# Altium project WR_NIC.PrjPcb (part 2 of 3)

## Sheet 11-DisplayPort.SchDoc
size B; SheetNumber: 10; SheetTotal: 19
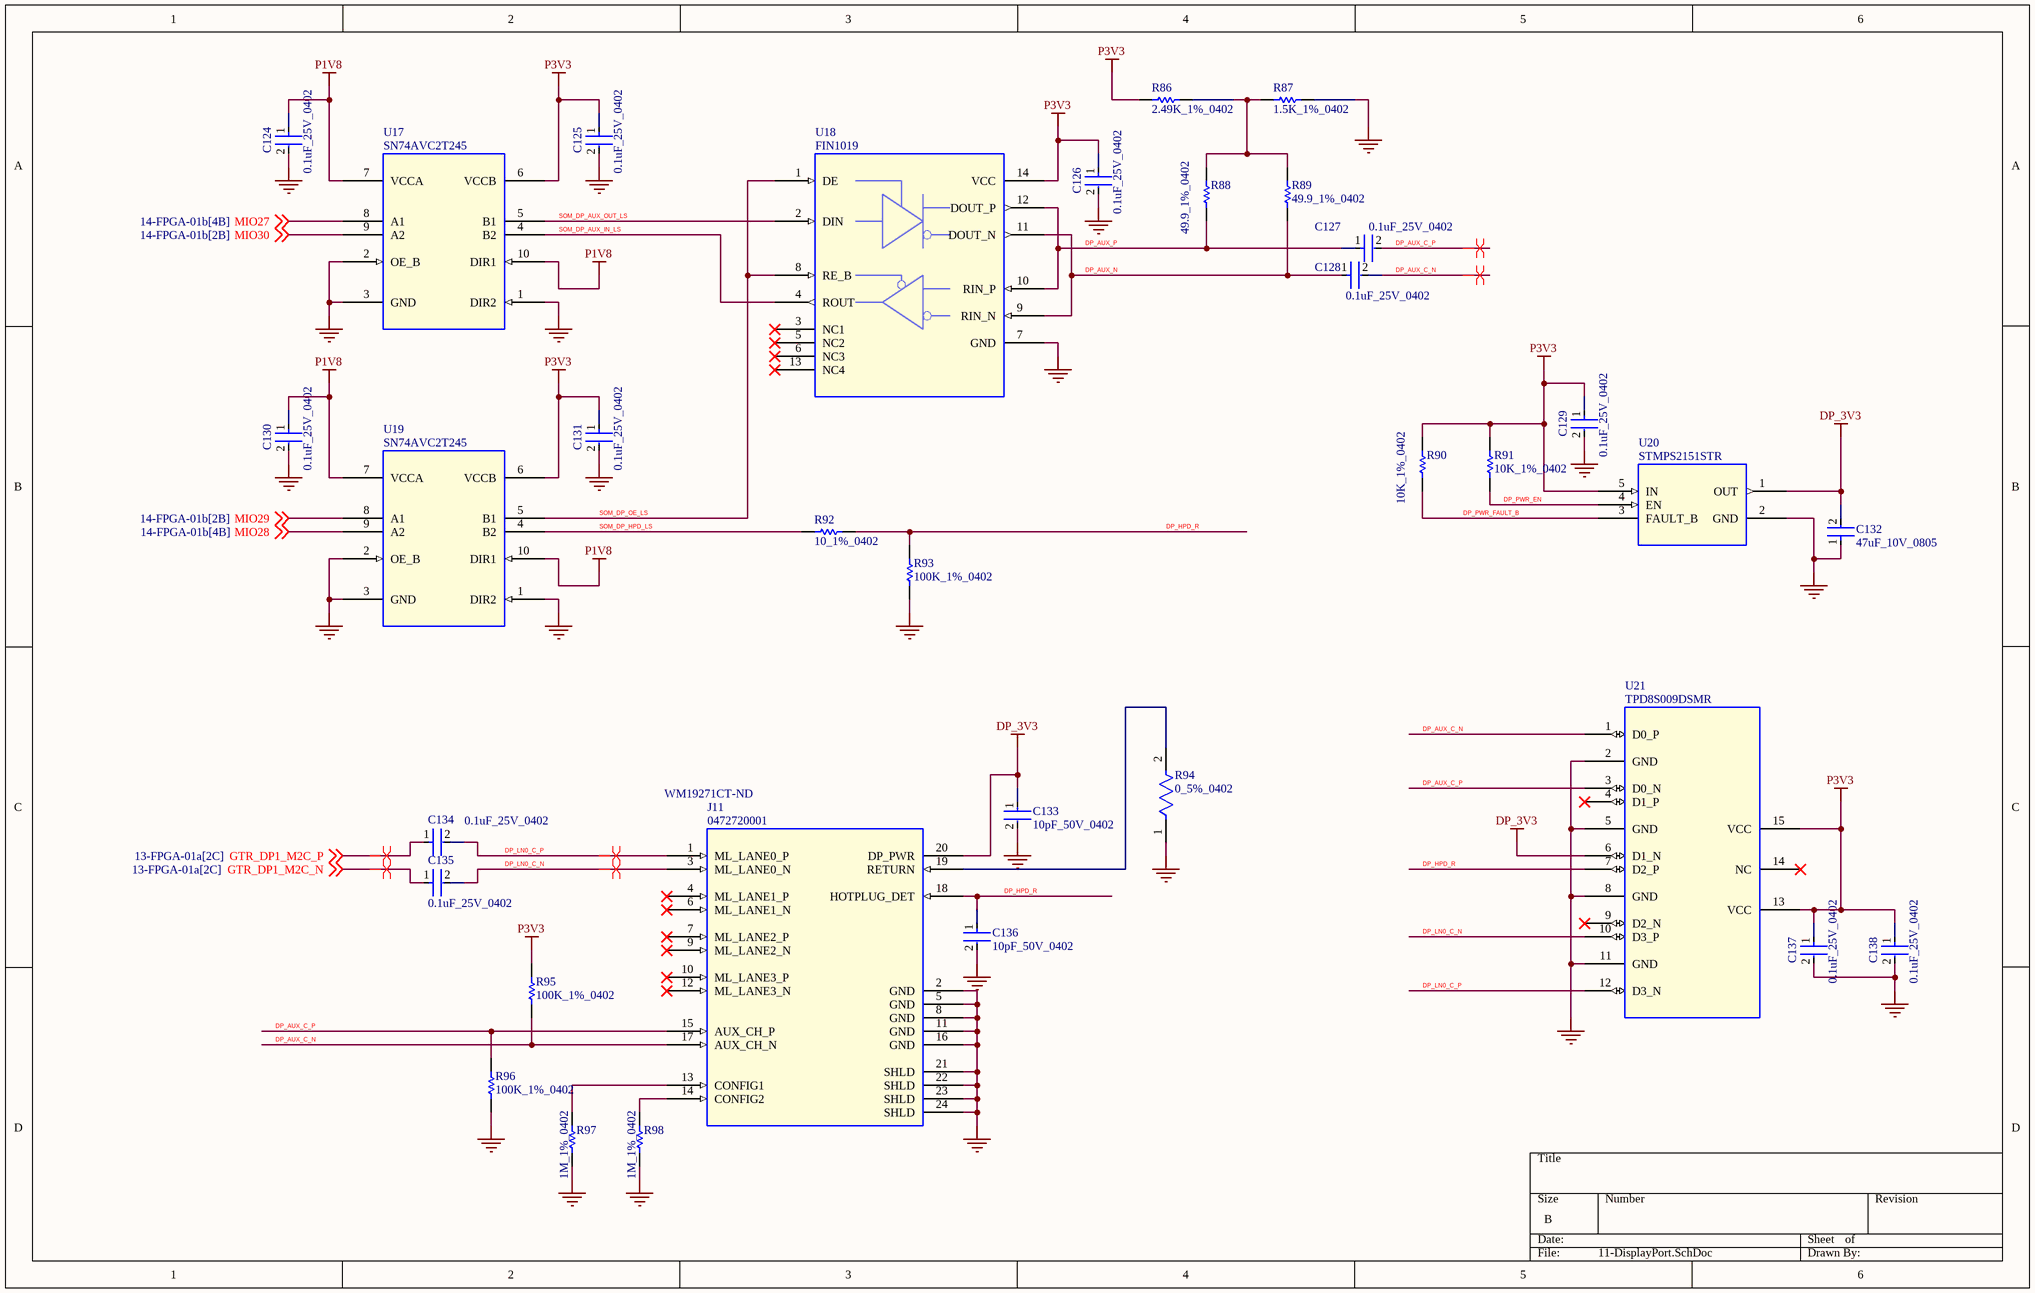
[diagram p5: 11-DisplayPort.SchDoc]

### Parts
C124  0.1uF_25V_0402  [FP-0402-L_1_0_1-W_0_5_0_1-IPC_C]
C125  0.1uF_25V_0402  [FP-0402-L_1_0_1-W_0_5_0_1-IPC_C]
C126  0.1uF_25V_0402  [FP-0402-L_1_0_1-W_0_5_0_1-IPC_C]
C127  0.1uF_25V_0402  [FP-0402-L_1_0_1-W_0_5_0_1-IPC_C]
C128  0.1uF_25V_0402  [FP-0402-L_1_0_1-W_0_5_0_1-IPC_C]
C129  0.1uF_25V_0402  [FP-0402-L_1_0_1-W_0_5_0_1-IPC_C]
C130  0.1uF_25V_0402  [FP-0402-L_1_0_1-W_0_5_0_1-IPC_C]
C131  0.1uF_25V_0402  [FP-0402-L_1_0_1-W_0_5_0_1-IPC_C]
C132  47uF_10V_0805  [FP-GRM21B-0_2-e0_2_0_7-IPC_A]
C133  10pF_50V_0402  [FP-C1005-050-0_05-IPC_C]
C134  0.1uF_25V_0402  [FP-0402-L_1_0_1-W_0_5_0_1-IPC_C]
C135  0.1uF_25V_0402  [FP-0402-L_1_0_1-W_0_5_0_1-IPC_C]
C136  10pF_50V_0402  [FP-C1005-050-0_05-IPC_C]
C137  0.1uF_25V_0402  [FP-0402-L_1_0_1-W_0_5_0_1-IPC_C]
C138  0.1uF_25V_0402  [FP-0402-L_1_0_1-W_0_5_0_1-IPC_C]
J11  0472720001  Supplier Part Number 1: WM19271CT-ND  [CON_MOLEX_47272]
R86  2.49K_1%_0402  [RESC1005X40X25ML05T05]
R87  1.5K_1%_0402  [RESC1005X40X25NL05T05]
R88  49.9_1%_0402  [RESC1005X40X25NL10T10]
R89  49.9_1%_0402  [RESC1005X40X25NL10T10]
R90  10K_1%_0402  [RESC1005X40X25ML05T05]
R91  10K_1%_0402  [RESC1005X40X25ML05T05]
R92  10_1%_0402  [RESC1005X40X25LL10T10]
R93  100K_1%_0402  [RESC1005X40X25ML05T05]
R94  0_5%_0402  [FP-AC0402-0_37-IPC_B]
R95  100K_1%_0402  [RESC1005X40X25ML05T05]
R96  100K_1%_0402  [RESC1005X40X25ML05T05]
R97  1M_1%_0402  [RESC1005X40X25NL10T10]
R98  1M_1%_0402  [RESC1005X40X25NL10T10]
U17  SN74AVC2T245  [QFN40P140X180X55-10]
U18  FIN1019  [TSSOP_14]
U19  SN74AVC2T245  [QFN40P140X180X55-10]
U20  STMPS2151STR  [SOT95P280X145_5]
U21  TPD8S009DSMR  [SON_15P]

### Nets
DP_3V3: C132.2 C133.1 J11.20(DP_PWR) U20.1(OUT) U21.6(D1_N)
GND: C124.2 C125.2 C126.2 C129.2 C130.2 C131.2 C132.1 C133.2 C136.2 C137.2 C138.2 J11.2(GND) J11.5(GND) J11.8(GND) J11.11(GND) J11.16(GND) J11.21(SHLD) J11.22(SHLD) J11.23(SHLD) J11.24(SHLD) R87.2 R93.2 R94.1 R96.1 R97.1 R98.1 U17.1(DIR2) U17.2(OE_B) U17.3(GND) U18.7(GND) U19.1(DIR2) U19.2(OE_B) U19.3(GND) U20.2(GND) U21.2(GND) U21.5(GND) U21.8(GND) U21.11(GND)
P1V8: C124.1 C130.1 U17.7(VCCA) U17.10(DIR1) U19.7(VCCA) U19.10(DIR1)
P3V3: C125.1 C126.1 C129.1 C131.1 C137.1 C138.1 R86.1 R90.2 R91.1 R95.2 U17.6(VCCB) U18.14(VCC) U19.6(VCCB) U20.5(IN) U21.13(VCC) U21.15(VCC)
DP_AUX_C_N: C128.2 J11.17(AUX_CH_N) R95.1 U21.1(D0_P)
DP_AUX_C_P: C127.2 J11.15(AUX_CH_P) R96.2 U21.3(D0_N)
DP_AUX_N: C128.1 R89.1 U18.9(RIN_N) U18.11(DOUT_N)
DP_AUX_P: C127.1 R88.1 U18.10(RIN_P) U18.12(DOUT_P)
DP_HPD_R: C136.1 J11.18(HOTPLUG_DET) R92.2 R93.1 U21.7(D2_P)
DP_LN0_C_N: C135.2 J11.3(ML_LANE0_N) U21.10(D3_P)
DP_LN0_C_P: C134.2 J11.1(ML_LANE0_P) U21.12(D3_N)
DP_PWR_EN: R91.2 U20.4(EN)
DP_PWR_FAULT_B: R90.1 U20.3(FAULT_B)
GTR_DP1_M2C_N: C135.1 ; off-sheet GTR_DP1_M2C_N
GTR_DP1_M2C_P: C134.1 ; off-sheet GTR_DP1_M2C_P
MIO27: U17.8(A1) ; off-sheet MIO27
MIO28: U19.9(A2) ; off-sheet MIO28
MIO29: U19.8(A1) ; off-sheet MIO29
MIO30: U17.9(A2) ; off-sheet MIO30
SOM_DP_AUX_IN_LS: U17.4(B2) U18.4(ROUT)
SOM_DP_AUX_OUT_LS: U17.5(B1) U18.2(DIN)
SOM_DP_HPD_LS: R92.1 U19.4(B2)
SOM_DP_OE_LS: U18.1(DE) U18.8(RE_B) U19.5(B1)
NetJ11_13: J11.13(CONFIG1) R97.2
NetJ11_14: J11.14(CONFIG2) R98.2
NetJ11_19: J11.19(RETURN) R94.2
NetR86_2: R86.2 R87.1 R88.2 R89.2

Not connected (* = marked no-connect by the designer): J11 4(ML_LANE1_P)* 6(ML_LANE1_N)* 7(ML_LANE2_P)* 9(ML_LANE2_N)* 10(ML_LANE3_P)* 12(ML_LANE3_N)*; U18 3(NC1)* 5(NC2)* 6(NC3)* 13(NC4)*; U21 4(D1_P)* 9(D2_N)* 14(NC)*

### Layout directives
differential pair: DP_AUX_C_N, DP_AUX_C_P, DP_LN0_C_N, DP_LN0_C_P, GTR_DP1_M2C_N, GTR_DP1_M2C_P

### Library data of the parts
C124-C131 C134 C135 C137 C138 = CMP-2008-02519-2: General Purpose Ceramic Capacitor, 0402, 100nF, 10%, X7R, 15%, 25V; Package Quantity: 1; Capacitance: 100nF; Min Operating Temperature: -55°C; Voltage: 25V; Voltage Rating: 25V; Construction: Flat; Max Operating Temperature: 125°C; Radiation Hardening: No; Depth: 0.5mm; Thickness: 0.022inch; Voltage Rating (DC): 25V; Number of Pins: 2; Lead Free: Lead Free; Series: -; REACH SVHC: No SVHC; Length: 1mm; Dielectric: X7R; RoHS Compliant: Yes; Mount: Surface Mount; Packaging: Tape and Reel; Case/Package: 0402; Case Code (Imperial): 0402; Termination: SMD/SMT; Width: 0.02inch; Case Code (Metric): 1005; Tolerance: 10%
C132 = CMP-2000-06341-2: Chip Multilayer Ceramic Capacitors for General Purpose, 0805, 47uF, X5R, 15%, 20%, 10V; Dissipation Factor: 0.035%; Length: 2mm; Voltage Rating: 10V; Mount: Surface Mount; Width: 0.049inch; Voltage Rating (DC): 10V; Lead Free: Lead Free; REACH SVHC: No SVHC; Termination: SMD/SMT; Case/Package: 0805; Dielectric: X5R; Capacitance: 47uF; Packaging: Tape and Reel; Max Operating Temperature: 85°C; Tolerance: 20%; Thickness: 0.057inch; Dielectric Material: Ceramic; Min Operating Temperature: -55°C; Height: 1.25mm; Case Code (Imperial): 0805; Case Code (Metric): 2012; Depth: 1.25mm; Voltage: 10V
C133 C136 = CMP-08246-002674-1: CAP CER 10PF 50V C0G 0402; Temperature Coefficient: 30ppm/°C; Dielectric Material: Ceramic; Termination: SMD/SMT; Width: 0.02inch; Case Code (Metric): 1005; Thickness: 0.022inch; Height: 0.5mm; REACH SVHC: No SVHC; Case Code (Imperial): 0402; Voltage: 50V; Capacitance: 10pF; Max Operating Temperature: 125°C; Length: 1mm; Construction: Flat; Packaging: Tape and Reel; Lead Free: Lead Free; Series: C; Depth: 0.5mm; Dielectric: C0G; Package Quantity: 1; Mount: Surface Mount; Voltage Rating (DC): 50V; Voltage Rating: 50V; Case/Package: 0402; RoHS Compliant: Yes; Min Operating Temperature: -55°C; Number of Pins: 2; Radiation Hardening: No; Weight: 2.3E-05oz
J11 = 0472720001: Conn Rcpt DisplayPort Female RA 20 Pos 0.5mm P Black SMT; Agile Part Number: CON-00139-01; Manufacturer: MOLEX; EDMVersionID: 488745758; Barcode: 400070; Part Type: RECEPTACLE; CIP Link: http://xsjbrdwin1/CIP-E/Component/Index/All?pn=400070; Manufacturer PN: 0472720001; PCB Footprint: CON_MOLEX_47272; Supplier 1: Digi-Key
R86 = CMP-2002-00377-1: Manufacturer: Vishay Dale; Part Number: CRCW04022K49FKTD
R87 = CMP-2002-08297-1: Part Number: CRCW04021K50FKED; Manufacturer: Vishay Dale
R88 R89 = CMP-2002-04448-1: Part Number: RK73H1ETTP49R9F; Manufacturer: KOA Speer
R90 R91 = CMP-2002-00433-1: Part Number: ERJ-2GEJ103X; Manufacturer: Panasonic
R92 = CMP-2002-04187-1: Part Number: RK73H1ETTP10R0F; Manufacturer: KOA Speer
R93 R95 R96 = CMP-1011-00736-2: Part Number: CRCW0402100KFKTD; Manufacturer: Vishay Dale
R94 = CMP-2002-01772-2: RESISTOR 0402 JUMPER ZERO OHM; Voltage Rating: 50V; Temperature Coefficient: 200ppm/°C; Tolerance: 1%; Power Rating: 62.5mW; Resistance: 0R; Min Operating Temperature: -55°C; Termination: SMD/SMT; Case/Package: 0402; Case Code (Imperial): 0402; Packaging: Tape and Reel; Case Code (Metric): 1005; Max Operating Temperature: 155°C; Series: AC
R97 R98 = CMP-2002-05706-1: Manufacturer: TE Connectivity / AMP; Part Number: CRG0402F1M0
U17 U19 = SN74AVC2T245: IC Lvl Trans 2-Bit Bidir 500Mbps 1.2-3.6V 50mA UQFN-10; Agile Part Number: ICS-00048-01; Manufacturer: TEXAS INSTRUMENTS; Manufacturer PN: SN74AVC2T245RSWR; EDMVersionID: 493023062; Barcode: 500012; Part Type: BUS TRANSCEIVER; CIP Link: http://xsjbrdwin1/CIP-E/Component/Index/All?pn=500012; PCB Footprint: QFN40P140X180X55-10
U18 = FIN1019: IC Lvl Trans LVTTL-LVDS Diff 400Mbps 3.3V 2.5nSec TSSOP-14; Agile Part Number: ICS-00279-01; Manufacturer: FAIRCHILD; Manufacturer PN: FIN1019MTCX; EDMVersionID: 489931726; Barcode: 500414; Part Type: LVDS DRIVER/RECEIVER; CIP Link: http://xsjbrdwin1/CIP-E/Component/Index/All?pn=500414; PCB Footprint: TSSOP_14
U20 = STMPS2151: IC Switch Power 500mA 2.7-5.5V 110mR SOT23-5; Agile Part Number: ICS-00662-01; Manufacturer: STMicroelectronics; Supply Voltage: Not Required; Barcode: 50000178; CIP Link: http://xsjbrdwin1/CIP-E/Component/Index/All?pn=50000178; Part Type: LOAD SWITCH; Manufacturer PN: STMPS2151STR; Datasheet: http://www.st.com/content/ccc/resource/technical/document/datasheet/e8/d7/48/25/eb/87/45/b3/CD00167470.pdf/files/CD00167470.pdf/jcr:content/translations/en.CD00167470.pdf; PCB Footprint: SOT95P280X145_5
U21 = TPD8S009DSMR: TVSD 8-Ch 5.5V 2.5A 25W 4GHz SON-15 8KV Contact Discharge; Agile Part Number: ICS-00196-01; Manufacturer: TEXAS INSTRUMENTS; EDMVersionID: 493517914; Barcode: 500262; PCB Footprint: SON_15P; CIP Link: http://xsjbrdwin1/CIP-E/Component/Index/All?pn=500262; Part Type: ESD PROTECTOR; Manufacturer PN: TPD8S009DSMR

## Sheet 12-USB Phy and Hub.SchDoc
size C; SheetNumber: 12; SheetTotal: 20
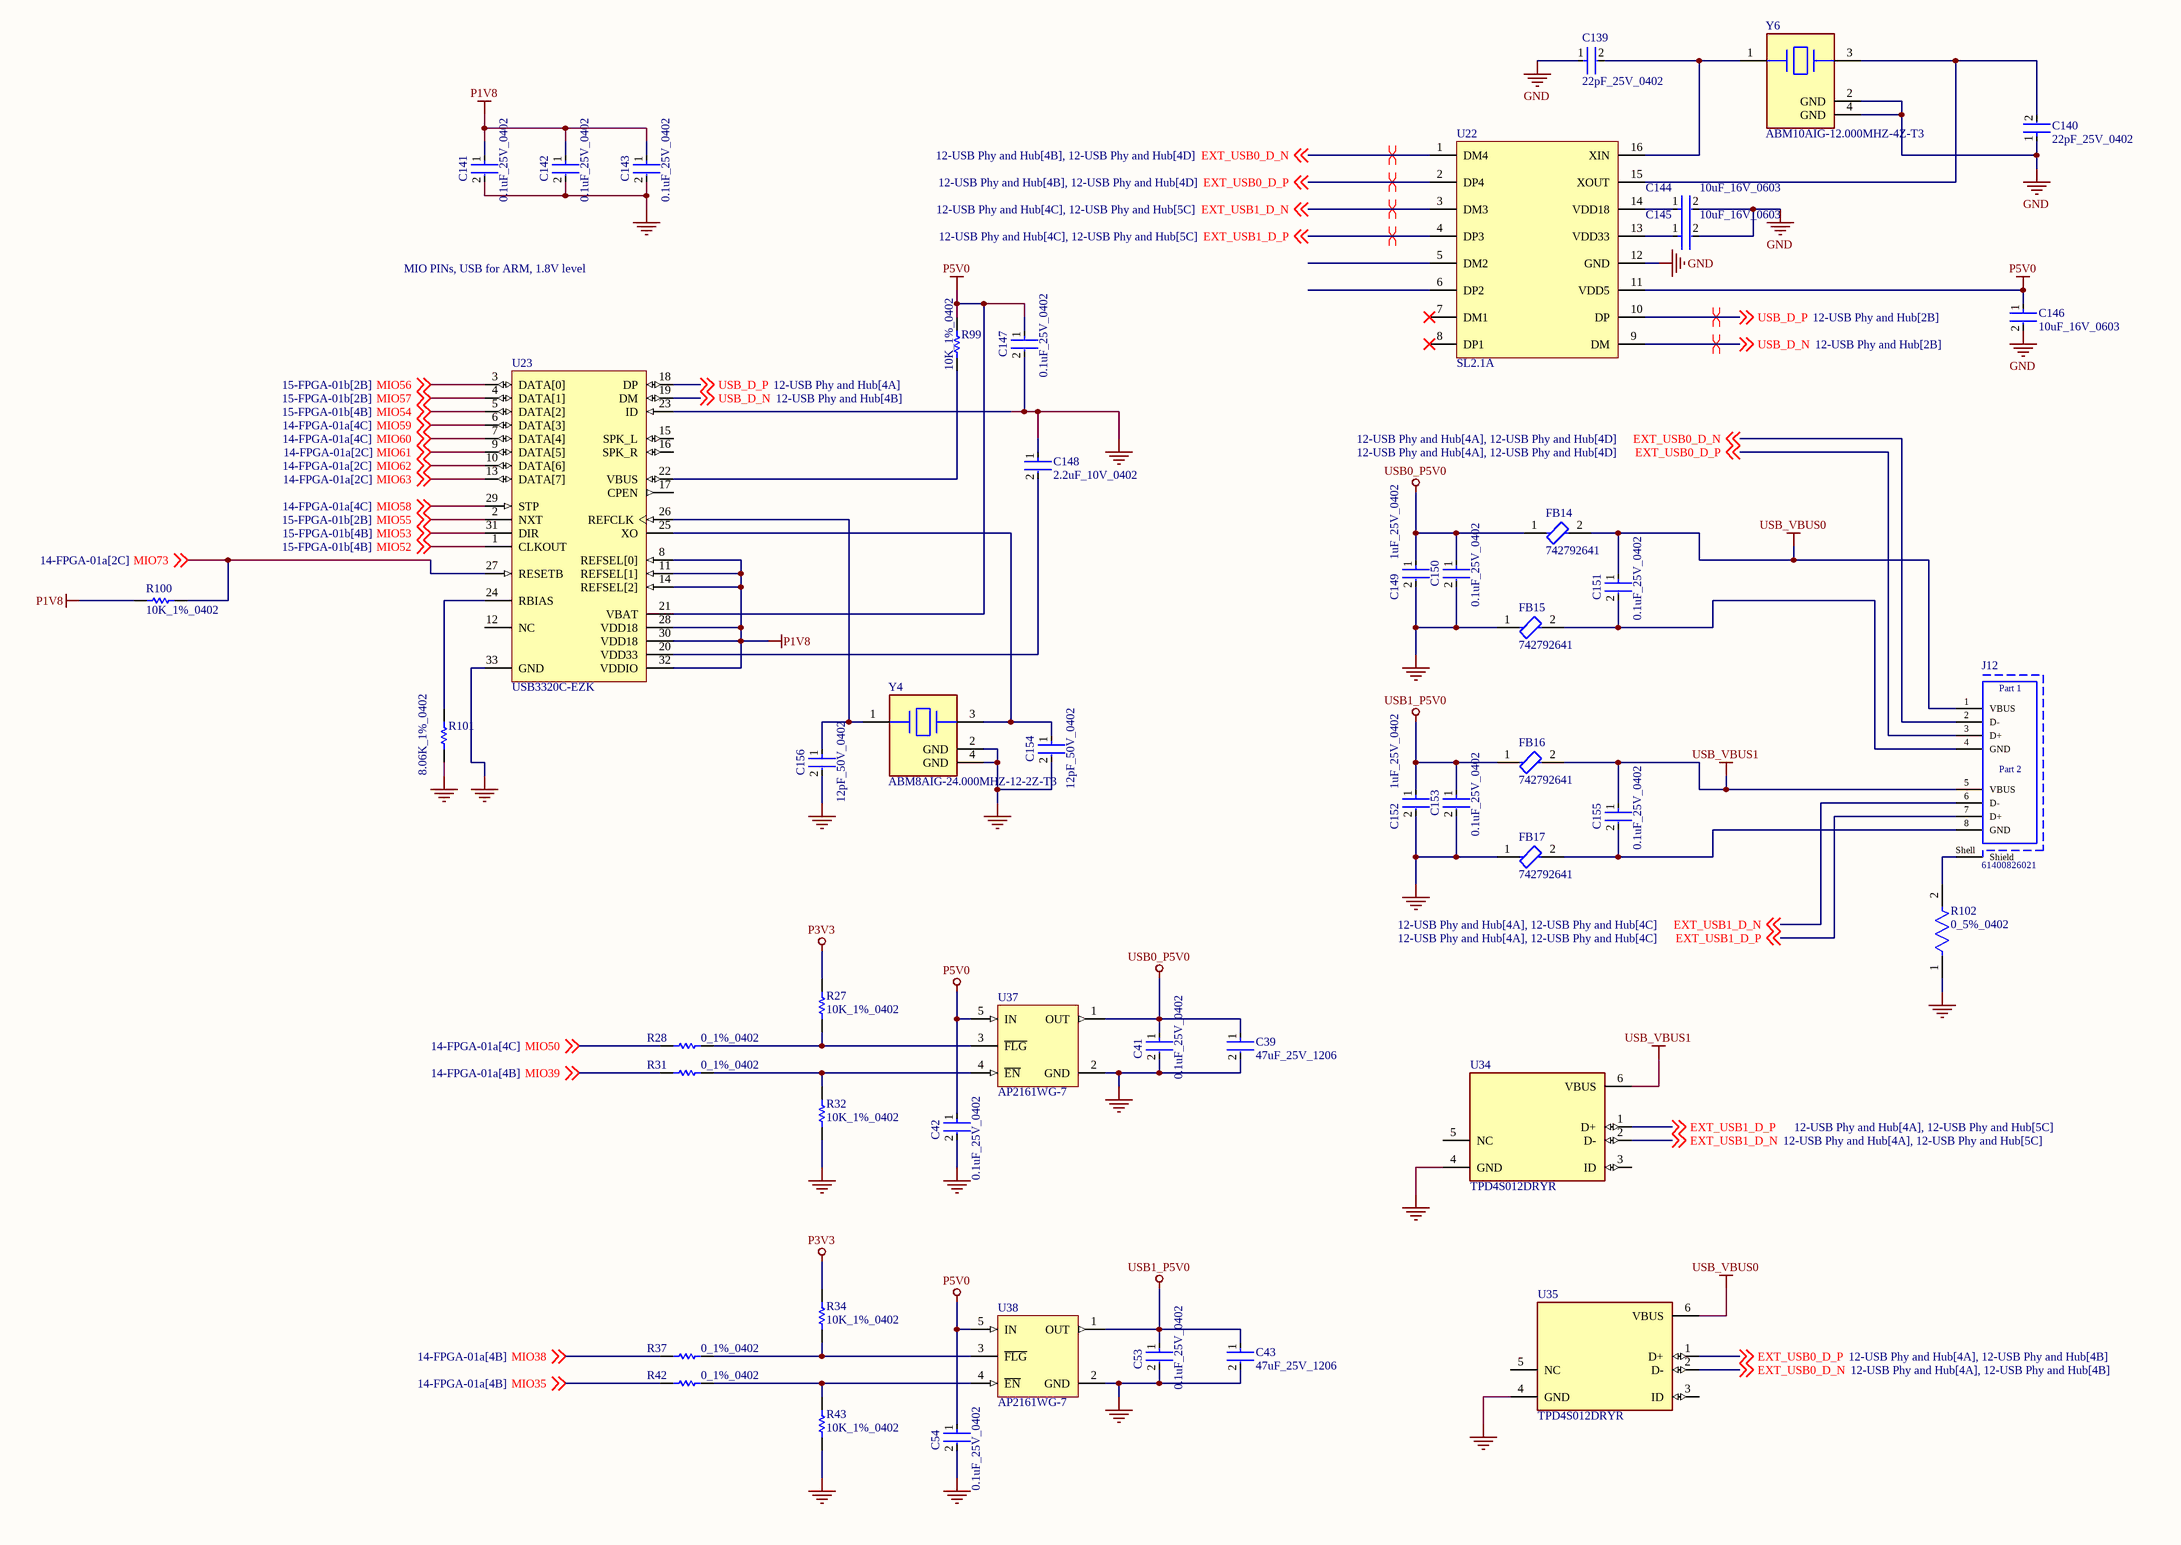
[diagram p6: 12-USB Phy and Hub.SchDoc]

### Parts
C39  47uF_25V_1206  [FP-C3216-160-0_2-MFG]
C41  0.1uF_25V_0402  [FP-0402-L_1_0_1-W_0_5_0_1-IPC_C]
C42  0.1uF_25V_0402  [FP-0402-L_1_0_1-W_0_5_0_1-IPC_C]
C43  47uF_25V_1206  [FP-C3216-160-0_2-MFG]
C53  0.1uF_25V_0402  [FP-0402-L_1_0_1-W_0_5_0_1-IPC_C]
C54  0.1uF_25V_0402  [FP-0402-L_1_0_1-W_0_5_0_1-IPC_C]
C139  22pF_25V_0402  [FP-C0402-BB-MFG]
C140  22pF_25V_0402  [FP-C0402-BB-MFG]
C141  0.1uF_25V_0402  [FP-0402-L_1_0_1-W_0_5_0_1-IPC_C]
C142  0.1uF_25V_0402  [FP-0402-L_1_0_1-W_0_5_0_1-IPC_C]
C143  0.1uF_25V_0402  [FP-0402-L_1_0_1-W_0_5_0_1-IPC_C]
C144  10uF_16V_0603  [FP-0603-L_1_6_0_2-W_0_8_0-MFG]
C145  10uF_16V_0603  [FP-0603-L_1_6_0_2-W_0_8_0-MFG]
C146  10uF_16V_0603  [FP-0603-L_1_6_0_2-W_0_8_0-MFG]
C147  0.1uF_25V_0402  [FP-0402-L_1_0_1-W_0_5_0_1-IPC_C]
C148  2.2uF_10V_0402  [FP-C1005-050-0_15-0_1-MFG]
C149  1uF_25V_0402  [FP-CL542-IPC_C]
C150  0.1uF_25V_0402  [FP-0402-L_1_0_1-W_0_5_0_1-IPC_C]
C151  0.1uF_25V_0402  [FP-0402-L_1_0_1-W_0_5_0_1-IPC_C]
C152  1uF_25V_0402  [FP-CL542-IPC_C]
C153  0.1uF_25V_0402  [FP-0402-L_1_0_1-W_0_5_0_1-IPC_C]
C154  12pF_50V_0402  [FP-0402-L_1_0_1-W_0_5_0_1-IPC_B]
C155  0.1uF_25V_0402  [FP-0402-L_1_0_1-W_0_5_0_1-IPC_C]
C156  12pF_50V_0402  [FP-0402-L_1_0_1-W_0_5_0_1-IPC_B]
FB14  742792641  [FP-742792641-MFG]
FB15  742792641  [FP-742792641-MFG]
FB16  742792641  [FP-742792641-MFG]
FB17  742792641  [FP-742792641-MFG]
J12  61400826021  [61400826021]
R27  10K_1%_0402  [RESC1005X40X25NL10T10]
R28  0_1%_0402  [RESC1005X40X25LL05T05]
R31  0_1%_0402  [RESC1005X40X25LL05T05]
R32  10K_1%_0402  [RESC1005X40X25NL10T10]
R34  10K_1%_0402  [RESC1005X40X25NL10T10]
R37  0_1%_0402  [RESC1005X40X25LL05T05]
R42  0_1%_0402  [RESC1005X40X25LL05T05]
R43  10K_1%_0402  [RESC1005X40X25NL10T10]
R99  10K_1%_0402  [RESC1005X40X25NL10T10]
R100  10K_1%_0402  [RESC1005X40X25NL10T10]
R101  8.06K_1%_0402  [RESC1005X40X25ML05T05]
R102  0_5%_0402  [FP-AC0402-0_37-IPC_B]
U22  SL2.1A  [IC_SL2.1A]
U23  USB3320C-EZK  [MCHP-QFN-32-5x5_V2]
U34  TPD4S012DRYR  [FP-DRY0006A-MFG]
U35  TPD4S012DRYR  [FP-DRY0006A-MFG]
U37  AP2161WG-7  [DIOD-SOT25-5_V]
U38  AP2161WG-7  [DIOD-SOT25-5_V]
Y4  ABM8AIG-24.000MHZ-12-2Z-T3  [FP-ABM8AIG-MFG]
Y6  ABM10AIG-12.000MHZ-4Z-T3  [FP-ABM10AIG-MFG]

### Nets
GND: C39.2 C41.2 C42.2 C43.2 C53.2 C54.2 C139.1 C140.1 C141.2 C142.2 C143.2 C144.2 C145.2 C146.2 C147.2 C148.1 C149.2 C150.2 C152.2 C153.2 C154.2 C156.2 FB15.1 FB17.1 R32.1 R43.1 R101.1 R102.1 U22.12(GND) U23.23(ID) U23.33(GND) U34.4(GND) U35.4(GND) U37.2(GND) U38.2(GND) Y4.2(GND) Y4.4(GND) Y6.2(GND) Y6.4(GND)
P1V8: C141.1 C142.1 C143.1 R100.1 U23.8(REFSEL[0]) U23.11(REFSEL[1]) U23.14(REFSEL[2]) U23.28(VDD18) U23.30(VDD18) U23.32(VDDIO)
P3V3: R27.2 R34.2
P5V0: C42.1 C54.1 C146.1 C147.1 R99.2 U22.11(VDD5) U23.21(VBAT) U37.5(IN) U38.5(IN)
USB0_P5V0: C39.1 C41.1 C149.1 C150.1 FB14.1 U37.1(OUT)
USB1_P5V0: C43.1 C53.1 C152.1 C153.1 FB16.1 U38.1(OUT)
USB_VBUS0: C151.1 FB14.2 J12.1(VBUS) U35.6(VBUS)
USB_VBUS1: C155.1 FB16.2 J12.5(VBUS) U34.6(VBUS)
EXT_USB0_D_N: J12.2(D-) U22.1(DM4) U35.2(D-) ; off-sheet EXT_USB0_D_N
EXT_USB0_D_P: J12.3(D+) U22.2(DP4) U35.1(D+) ; off-sheet EXT_USB0_D_P
EXT_USB1_D_N: J12.6(D-) U22.3(DM3) U34.2(D-) ; off-sheet EXT_USB1_D_N
EXT_USB1_D_P: J12.7(D+) U22.4(DP3) U34.1(D+) ; off-sheet EXT_USB1_D_P
MIO35: R42.1 ; off-sheet MIO35
MIO38: R37.1 ; off-sheet MIO38
MIO39: R31.1 ; off-sheet MIO39
MIO50: R28.1 ; off-sheet MIO50
MIO52: U23.1(CLKOUT) ; off-sheet MIO52
MIO53: U23.31(DIR) ; off-sheet MIO53
MIO54: U23.5(DATA[2]) ; off-sheet MIO54
MIO55: U23.2(NXT) ; off-sheet MIO55
MIO56: U23.3(DATA[0]) ; off-sheet MIO56
MIO57: U23.4(DATA[1]) ; off-sheet MIO57
MIO58: U23.29(STP) ; off-sheet MIO58
MIO59: U23.6(DATA[3]) ; off-sheet MIO59
MIO60: U23.7(DATA[4]) ; off-sheet MIO60
MIO61: U23.9(DATA[5]) ; off-sheet MIO61
MIO62: U23.10(DATA[6]) ; off-sheet MIO62
MIO63: U23.13(DATA[7]) ; off-sheet MIO63
MIO73: R100.2 U23.27(RESETB) ; off-sheet MIO73
USB_D_N: U22.9(DM) U23.19(DM) ; off-sheet USB_D_N
USB_D_P: U22.10(DP) U23.18(DP) ; off-sheet USB_D_P
NetC139_2: C139.2 U22.16(XIN) Y6.1(1_Crystal)
NetC140_2: C140.2 U22.15(XOUT) Y6.3(2_Crystal)
NetC144_1: C144.1 U22.14(VDD18)
NetC145_1: C145.1 U22.13(VDD33)
NetC148_2: C148.2 U23.20(VDD33)
NetC151_2: C151.2 FB15.2 J12.4(GND)
NetC154_1: C154.1 U23.25(XO) Y4.3
NetC155_2: C155.2 FB17.2 J12.8(GND)
NetC156_1: C156.1 U23.26(REFCLK) Y4.1
NetJ12_Shell: J12.Shell(Shield) R102.2
NetR27_1: R27.1 R28.2 U37.3(~{FLG})
NetR31_2: R31.2 R32.2 U37.4(~{EN})
NetR34_1: R34.1 R37.2 U38.3(~{FLG})
NetR42_2: R42.2 R43.2 U38.4(~{EN})
NetR99_1: R99.1 U23.22(VBUS)
NetR101_2: R101.2 U23.24(RBIAS)

Not connected (* = marked no-connect by the designer): U22 5(DM2) 6(DP2) 7(DM1)* 8(DP1)*; U23 12(NC) 15(SPK_L) 16(SPK_R) 17(CPEN); U34 3(ID) 5(NC); U35 3(ID) 5(NC)

### Layout directives
differential pair: EXT_USB0_D_N, EXT_USB0_D_P, EXT_USB1_D_N, EXT_USB1_D_P, USB_D_N, USB_D_P

### Notes on the sheet
- MIO PINs, USB for ARM, 1.8V level
- (in symbol CMP-1502-03229-1) Part 1; Part 2

### Library data of the parts
C39 C43 = CMP-2000-05397-3: Multilayer Ceramic Capacitors 47uF ±20% 25V X5R SMD 1206; Weight: 0.000571oz; Dielectric: X5R; Length: 0.126inch; Voltage Rating: 25V; Case/Package: 1206; Dielectric Material: Ceramic; Min Operating Temperature: -55°C; Lead Free: Lead Free; Packaging: Tape and Reel; Package Quantity: 1; Mount: Surface Mount; Depth: 1.6mm; REACH SVHC: No SVHC; Termination: SMD/SMT; Case Code (Imperial): 1206; Series: C; Resistor Type: Ceramic; Voltage: 25V; Width: 0.063inch; Height: 1.6mm; Tolerance: 20%; Capacitance: 47uF; Max Operating Temperature: 85°C; Voltage Rating (DC): 25V; RoHS Compliant: Yes; Thickness: 0.071inch; Case Code (Metric): 3216
C41 C42 C53 C54 C141-C143 C147 C150 C151 C153 C155 = CMP-2008-02519-2: as C124 on sheet 11-DisplayPort; Package Quantity: 1; Capacitance: 100nF; Min Operating Temperature: -55°C; Voltage: 25V; Voltage Rating: 25V; Construction: Flat; Max Operating Temperature: 125°C; Radiation Hardening: No; Depth: 0.5mm; Thickness: 0.022inch; Voltage Rating (DC): 25V; Number of Pins: 2; Lead Free: Lead Free; Series: -; REACH SVHC: No SVHC; Length: 1mm; Dielectric: X7R; RoHS Compliant: Yes; Mount: Surface Mount; Packaging: Tape and Reel; Case/Package: 0402; Case Code (Imperial): 0402; Termination: SMD/SMT; Width: 0.02inch; Case Code (Metric): 1005; Tolerance: 10%
C139 C140 = CMP-2008-03308-2: CAP CER 22PF 25V 5% NP0 0402; Manufacturer: Kemet; Manufacturer Part Number: C0402C220J3GACTU; Tolerance: 0.05; Temperature Characteristic: C0G; Material: Ceramic; Temperature Coefficient: 15%; Temperature Range High: +125°C; Automotive: No; Value: 22 pF; Category: Cap; Package: C0402-BB; Voltage Rating: 25 V; ComponentLink2URL: https://content.kemet.com/datasheets/KEM_C1002_X7R_SMD.pdf; Digikey Description: CAP CER 22PF 25V 5% NP0 0402; Device Class L2: Capacitors; Height: 0.55mm; Octopart: https://octopart.com/c0402c220j3gactu-kemet-8375716; Ipc Land Pattern Name: CAPC10050X50; Capacitance: 22 pF; Temperature: -55°C to +125°C; ComponentLink2Description: Datasheet; Temperature Range Low: -55°C; Device Class L1: Passive Components; RoHS: TRUE; Lead Free: Yes; Mouser Description: Multilayer Ceramic Capacitors MLCC - SMD/SMT 25volts 22pF C0G 5%; Device Class L3: Ceramic Capacitors
C144-C146 = CMP-2000-06226-4: Multilayer Ceramic Capacitor 10uF 16V X5R 20% SMD 0603 T/R; Packaging: Tape and Reel; Construction: Flat; Height: 0.8mm; Max Operating Temperature: 85°C; Dielectric: X5R; Case Code (Metric): 1608; Voltage Rating (DC): 16V; Width: 0.031inch; Voltage Rating: 16V; Length: 0.063inch; RoHS Compliant: Yes; Halogen Free: Halogen Free; Case Code (Imperial): 0603; Capacitance: 10uF; Mount: Surface Mount; Thickness: 0.031inch; Tolerance: 20%; Min Operating Temperature: -55°C; Series: M; Termination: SMD/SMT; Case/Package: 0603; Package Quantity: 1
C148 = CMP-08246-004344-1: CAP CER 2.2UF 10V X7S 0402; Dielectric Material: Ceramic; Tolerance: 10%; Mount: Surface Mount; Height: 0.5mm; Package Quantity: 1; Depth: 0.5mm; RoHS Compliant: Yes; Length: 1mm; Thickness: 0.022inch; Packaging: Tape and Reel; Capacitance: 2.2uF; Case Code (Imperial): 0402; Resistor Type: Ceramic; Dielectric: X7S; Case/Package: 0402; Min Operating Temperature: -55°C; Voltage Rating: 10V; Series: C; Weight: 2.3E-05oz; Width: 0.02inch; Voltage Rating (DC): 10V; Case Code (Metric): 1005; Max Operating Temperature: 125°C; Termination: SMD/SMT; Lead Free: Lead Free
C149 C152 = CMP-13271-001051-1: Cap Ceramic 1uF 25V X5R ±10% SMD 0402 +85°C Paper T/R; Radiation Hardening: No; Lead Free: Lead Free; Capacitance: 1uF; Package Quantity: 10000; Max Operating Temperature: 85°C; Voltage Rating: 25V; Case/Package: 0402; Min Operating Temperature: -55°C; Packaging: Tape and Reel; Tolerance: 10%; Height: 0.5mm; Thickness: 0.022inch; Case Code (Metric): 1005; Width: 0.02inch; Case Code (Imperial): 0402; Dielectric: X5R; Length: 1mm; Mount: Surface Mount; Material: Ceramic; Depth: 0.5mm
C154 C156 = CMP-2008-02574-2: General Purpose Ceramic Capacitor, 0402, 12pF, 5%, C0G, 30ppm/°C, 50V; Insulation Resistance: 100GR; Radiation Hardening: No; RoHS Compliant: Yes; Voltage Rating: 50V; Case Code (Imperial): 0402; Height: 0.5mm; Voltage: 50V; Voltage Rating (DC): 50V; Mount: Surface Mount; Capacitance: 12pF; Thickness: 0.022inch; Depth: 0.5mm; Max Operating Temperature: 125°C; Construction: Flat; Termination: SMD/SMT; Tolerance: 5%; Length: 1mm; Lead Free: Lead Free; Dielectric: C0G; Number of Pins: 2; Package Quantity: 1; Series: -; Temperature Coefficient: 30ppm/°C; Min Operating Temperature: -55°C; Case/Package: 0402; Packaging: Tape and Reel; Case Code (Metric): 1005; Width: 0.02inch; REACH SVHC: No SVHC
FB14-FB17 = CMP-0220-00171-2: FERRITE BEAD 300 OHM 0603 1LN; Inductance: 18nH; Max DC Current: 2A; Number of Lines: 1; Test Frequency: 100MHz; Impedance: 300R; DC Resistance (DCR): 150mR; Tolerance: 25%; Case Code (Metric): 1608; Core Material: Ferrite; Length: 1.6mm; Lead Free: Lead Free; Series: WE-CBF; Min Operating Temperature: -55°C; RoHS Compliant: Yes; Case/Package: SMD/SMT; Material: Ferrite; Max Operating Temperature: 125°C; Termination: SMD/SMT; Packaging: Tape and Reel; Weight: 0.000141oz; Case Code (Imperial): 0603; Width: 0.8mm; Mount: Surface Mount; Max Current Rating: 2A; Package Quantity: 1; Depth: 0.8mm; Current Rating: 2A; Height: 0.8mm
J12 = CMP-1502-03229-1: USB 2.0 Type A Receptacle WR-COM, Stacked Horizontal, THT; Manufacturer: Wurth Elektronik; Contact Resistance: 20mOhm; Rated Current: 1.5A; Working Voltage: 30VAC; Connector Type: USB2.0TypeA; Packaging: Tray; Package Reference: 61400826021; Mounting Technology: THT; Datasheet URL: https://katalog.we-online.de/em/datasheet/61400826021.pdf; Operating Temperature: -40to105degC; Gender: Receptacle; Orientation: StackedHorizontal; Part Number: 61400826021; Publisher: WurthElektronik; Manufacturer URL: http://www.we-online.de
R27 R32 R34 R43 R99 R100 = CMP-2002-04694-1: Manufacturer: Bourns; Part Number: CR0402-FX-1002GLF
R28 R31 R37 R42 = CMP-2000-07451-1: Chip Resistor, 0 Ohm, 0.1 W, -55 to 155 degC, 0402 (1005 Metric), RoHS, Tape and Reel; Manufacturer: Panasonic; Voltage Rating (DC): 50V; Temperature Coefficient: 600ppm/��C; Max Power Dissipation: 100mW; Resistance: 0mOhm; Tolerance: 5%; Number of Terminations: 2; Mount: SurfaceMount; Height: 0.35mm; Packaging: TapeandReel; Contact Plating: Tin; Manufacturer URL: http://www.panasonic.com/; Composition: ThickFilm; Max Operating Temperature: 155degC; REACH SVHC: NoSVHC; Case/Package: 0402; Package Reference: 402; Depth: 0.5mm; Package Description: 2-Pin Surface Mount Device, Body 1 x 0.5 mm; Datasheet URL: https://industrial.panasonic.com/cdbs/www-data/pdf/RDA0000/AOA0000C301.pdf; RoHSCompliant: True; Case Code (Imperial): 0402; Military Standard: Not; Min Operating Temperature: -55degC; Power Rating: 100mW; Datasheet Version: 03/2015; Length: 1mm; Case Code (Metric): 1005; Termination: SMD/SMT; Mounting Technology: SurfaceMount; Voltage Rating: 50V; Width: 0.02inch; Package Quantity: 1; Lead Free: LeadFree; Radiation Hardening: No
R101 = CMP-2002-00253-3: Chip Resistor, 8.06 KOhm, +/- 1%, 63 mW, -55 to 155 degC, 0402 (1005 Metric), RoHS, Tape and Reel; PartNumber: CRCW04028K06FKED; Manufacturer: Basic Passives; Case\/Package: 0402; Power Rating: 63 mW; Voltage Rating: 50 V; PackageReference: 0402; Radiation Hardening: No; Package Quantity: 10000; Height: 0.35 mm; Packaging: Tape and Reel; Mount: Surface Mount; Length: 1 mm; Weight: 2.3E-05oz; Case Code (Metric): 1005; DatasheetVersion: 06/2012; Pins: 2; Min Operating Temperature: -55 degC; Case Code (Imperial): 0402; REACH SVHC: Unknown; Tolerance: 1%; Mounting Technology: Surface Mount; ComponentLink1URL: http://www.vishay.com/; ComponentLink2URL: http://www.vishay.com/docs/20035/dcrcwe3.pdf; ComponentLink2Description: Datasheet; Resistance: 8.06 KOhm; Max Operating Temperature: 155 degC; ComponentLink1Description: Manufacturer URL; Width: 0.5 mm; RoHSCompliant: true; PackageDescription: 2-Pin Surface Mount Device, Body 1 x 0.5 mm
R102 = CMP-2002-01772-2: as R94 on sheet 11-DisplayPort; Min Operating Temperature: -55°C; Termination: SMD/SMT; Case/Package: 0402; Case Code (Imperial): 0402; Packaging: Tape and Reel; Case Code (Metric): 1005; Max Operating Temperature: 155°C; Series: AC
U22 = IC_SL2.1A: USB 2.0 HIGH SPEED 4-PORT HUB CONTROLLER; MF: CoreChips ShenZhen CO.,Ltd; Check_prices: https://www.snapeda.com/parts/SL2.1A/CoreChips%20ShenZhen%20CO.,Ltd/view-part/4219225/?ref=eda; Price: None; Availability: No availability data; Value: *; SnapEDA_Link: https://www.snapeda.com/parts/SL2.1A/CoreChips%20ShenZhen%20CO.,Ltd/view-part/4219225/?ref=snap; MP: SL2.1A; Package: Package; Supplier 1: LCSC; Supplier Part Number 1: C192893
U23 = CMP-0186-00335-1: Highly Integrated Full Featured Hi-Speed USB 2.0 ULPI Transceiver, 1.8 to 3.3 V, -40 to 85 degC, 32-Pin QFN (QFN-3304), RoHS, Tray; Manufacturer: Microchip; VVBAT: 3.1 to 5.5 V; REFCLK Frequency@ULPI Input Clock Mode: 60 MHz; Cpin: 4 pF Max.; VDD33: 3 to 3.6 V; Mounting Technology: Surface Mount; I/O Voltage: 1.8 to 3.3 V; ComponentLink3URL: http://ww1.microchip.com/downloads/en/DeviceDoc/00001792A.pdf; PackageDescription: 32-Pin Quad Flat Non-Leaded Package, Body 5 x 5 mm, Pitch 0.5 mm; ComponentLink2URL: http://ww1.microchip.com/downloads/en/DeviceDoc/00001792A.pdf; Temperature Range: -40 to 85 degC; ComponentLink2Description: Datasheet; ComponentLink1URL: www.microchip.com/; ComponentLink3Description: Package Specification; Packing: Tray; ComponentLink1Description: Manufacturer URL; PartNumber: USB3320C-EZK; PackageVersion: Rev. H; DatasheetVersion: DS00001792A; RoHS: TRUE
U34 U35 = CMP-0326-00038-4: TVS DIODE 5.5V 6SON; Breakdown Voltage: 24V; Interface: USB; ESD Protection: Yes; Peak Pulse Power: 60W; Number of Circuits: 4; Polarity: Unidirectional; Capacitance: 15pF; Test Current: 1mA; Working Voltage: 19V; Min Breakdown Voltage: 6V; Peak Pulse Current: 3A; Operating Supply Voltage: 950mV; Max Operating Temperature: 85°C; Packaging: Tape and Reel; Termination: SMD/SMT; Number of Pins: 6; Radiation Hardening: No; Width: 1.05mm; REACH SVHC: No SVHC; Lead Free: Lead Free; Depth: 1mm; Package Quantity: 5000; Length: 1.45mm; Direction: Unidirectional; Min Operating Temperature: -40°C; Number of Channels: 4; Max Power Dissipation: 60W; Height: 0.55mm
U37 U38 = CMP-2000-05781-1: Single Channel Current-limited Power Switch / , 1 A, 2.7 to 5.5 V, -40 to 85 degC, 5-Pin SOT25, RoHS, Tape and Reel; Manufacturer: Diodes-Incorporated; Voltage - Supply (Vcc/Vdd): NotRequired; Interface: On/Off; Ratio - Input: Output:1:1; Input Type: Non-Inverting; Fault Protection: CurrentLimiting(Fixed),OverTemperature,ReverseCurrent,UVLO; Voltage - Load: 2.7V~5.5V; Number of Outputs: 1; Current - Output (Max): 1A; Output Configuration: HighSide; Output Type: P-Channel; Rds On (Typ): 95mOhm; Switch Type: USBSwitch; Family: PMIC-PowerDistributionSwitches,LoadDrivers; Package Reference: SOT25-5; Operating Temperature: -40°C~85°C(TA); Category: IntegratedCircuits(ICs); Datasheet URL: https://www.diodes.com/assets/Datasheets/AP2161_71.pdf; Manufacturer URL: http://www.diodes.com/; Package Description: 5-Pin Small Outline Transistor, Body 3 x 1.6 mm, Pitch 0.95 mm; Mounting Technology: SurfaceMount; Packaging: Tape&Reel(TR); Datasheet Version: Rev. 9-2, 08/2015; Supplier Device Package: SOT-25; Package / Case: SC-74A,SOT-753; Features: StatusFlag; Series: -
Y4 = CMP-27762-015716-1: Crystal 24MHz ±20ppm (Tol) ±50ppm (Stability) 12pF FUND 50Ω Automotive 4-Pin Ultra Mini-CSMD T/R; ESR (Equivalent Series Resistance): 50R; Series: ABM8AIG; RoHS Compliant: Yes; Load Capacitance: 12pF; Height: 0.031inch; Min Operating Temperature: -40°C; Mount: Surface Mount; Packaging: Cut Tape; Ratings: AEC-Q200; Case/Package: SMD/SMT; Frequency Stability: 50ppm; Max Operating Temperature: 125°C; Length: 0.126inch; Frequency: 24MHz; Frequency Tolerance: 20ppm; Width: 0.098inch
Y6 = CMP-27762-011014-1: Crystal 12MHz ±30ppm 10pF SMD-4 2.5mm x 2mm Automotive; Frequency Stability: 50ppm; ESR (Equivalent Series Resistance): 150R; Max Operating Temperature: 125°C; Frequency Tolerance: 30ppm; Frequency: 12MHz; RoHS Compliant: Yes; Mount: Surface Mount; Packaging: Tape and Reel; Case/Package: SMD/SMT; Load Capacitance: 10pF; Min Operating Temperature: -40°C; Length: 0.098inch; Height: 0.024inch; Width: 0.079inch; Ratings: AEC-Q200

## Sheet 15-FPGA-01b.SchDoc
size B; SheetNumber: 15; SheetTotal: 20
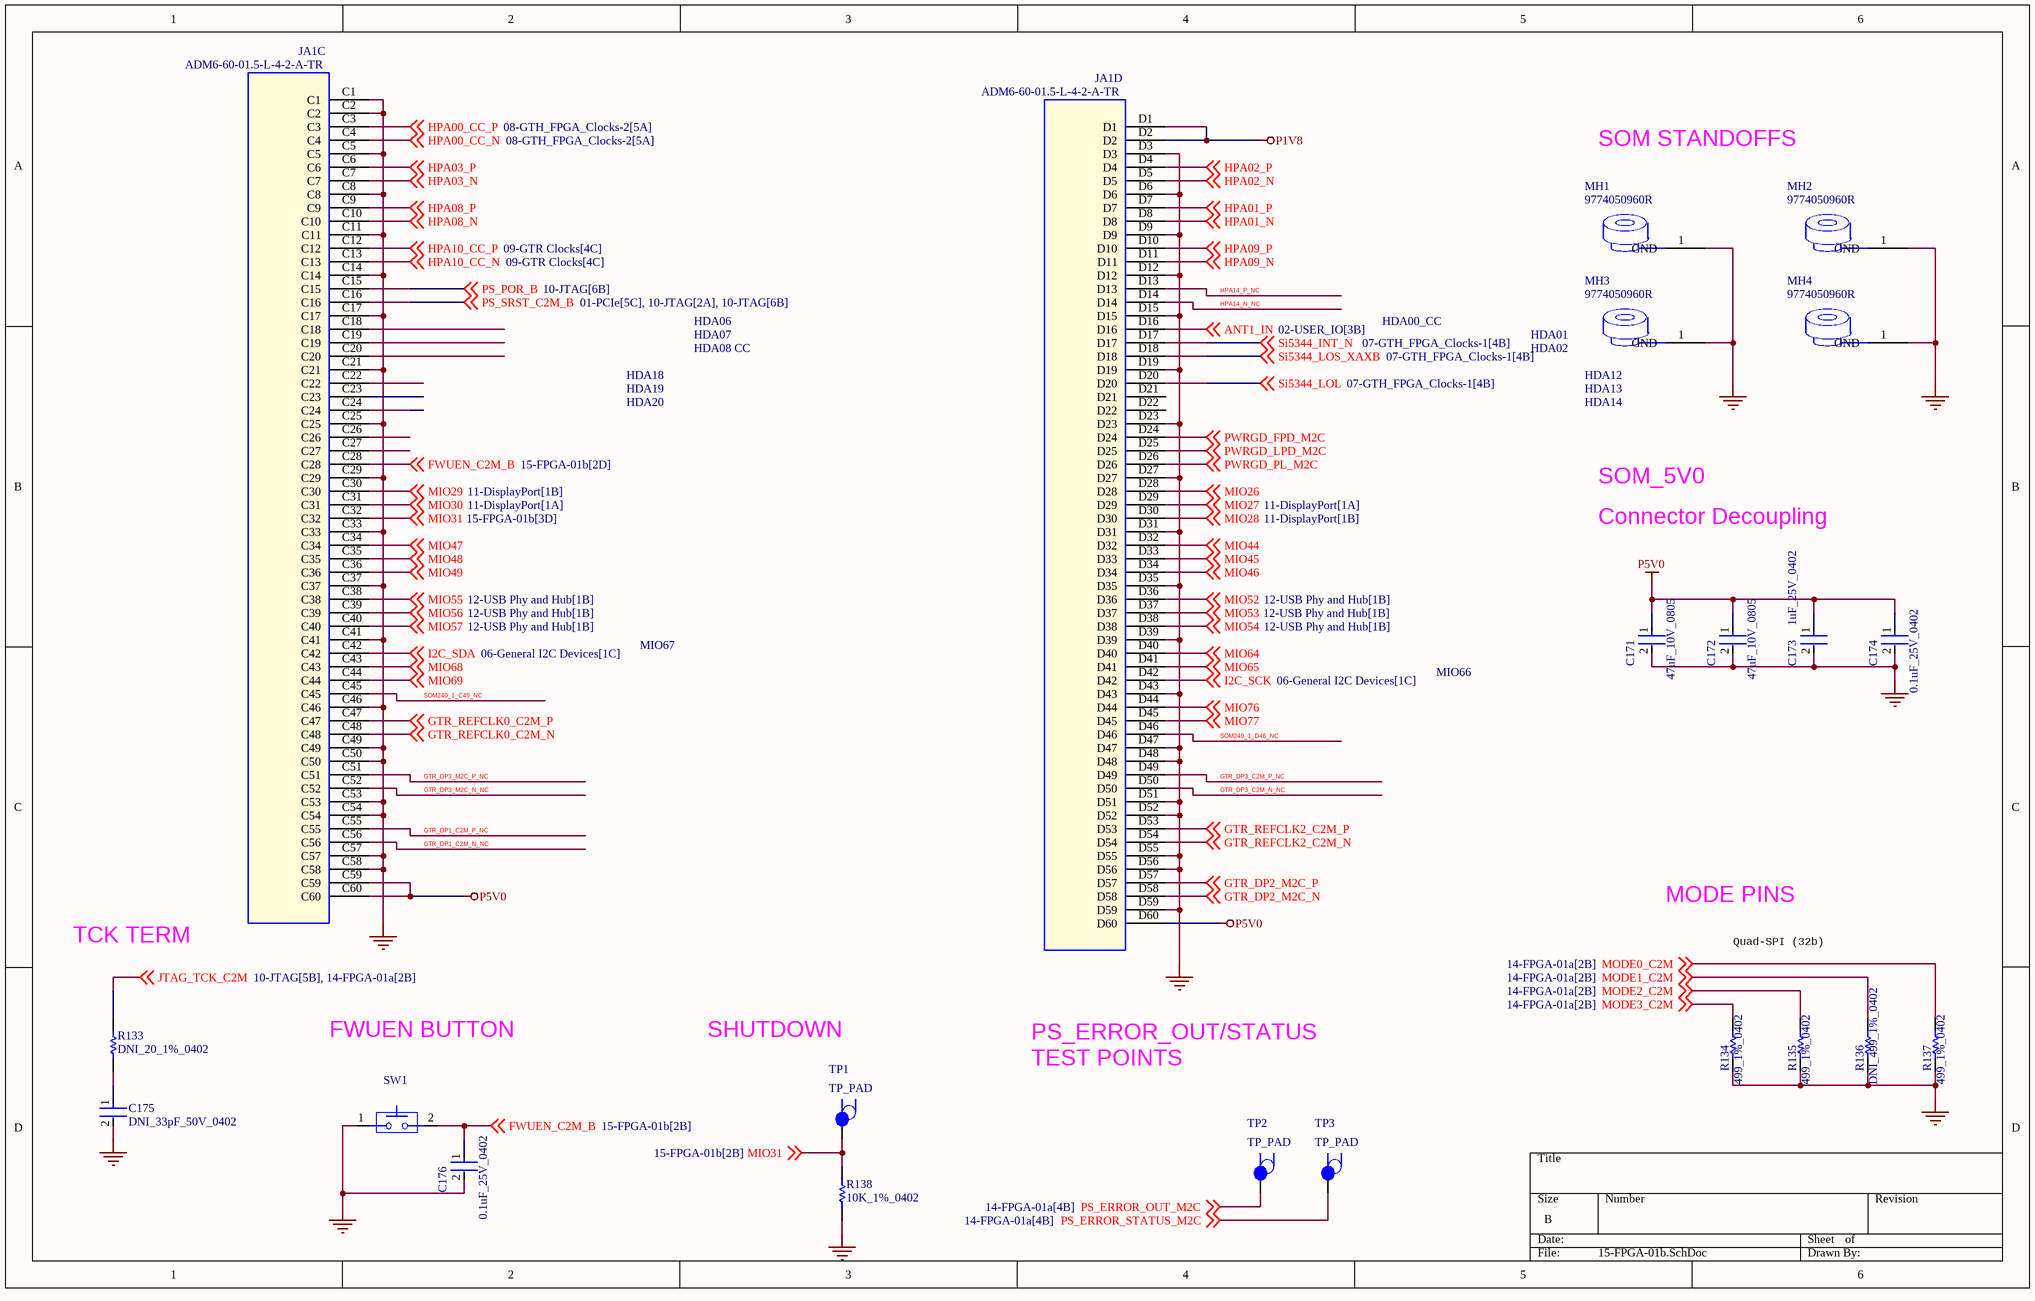
[diagram p7: 15-FPGA-01b.SchDoc]

### Parts
C171  47uF_10V_0805  [FP-GRM21B-0_2-e0_2_0_7-IPC_A]
C172  47uF_10V_0805  [FP-GRM21B-0_2-e0_2_0_7-IPC_A]
C173  1uF_25V_0402  [FP-CL542-IPC_C]
C174  0.1uF_25V_0402  [FP-0402-L_1_0_0_05-W_0_5-IPC_B]
C175  DNI_33pF_50V_0402  [FP-C1005-050-0_05-IPC_A]  (no BOM)
C176  0.1uF_25V_0402  [FP-0402-L_1_0_0_05-W_0_5-IPC_B]
JA1  ADM6-60-01.5-L-4-2-A-TR  [CON_SAMTEC_ADM6_60_4]  (parts C,D of 4)
MH1  9774050960R  [CON_WE_WA-SMST_6MM]
MH2  9774050960R  [CON_WE_WA-SMST_6MM]
MH3  9774050960R  [CON_WE_WA-SMST_6MM]
MH4  9774050960R  [CON_WE_WA-SMST_6MM]
R133  DNI_20_1%_0402  [RESC1005X40X25NL10T10]  (no BOM)
R134  499_1%_0402  [RESC1005X40X25LL05T05]
R135  499_1%_0402  [RESC1005X40X25LL05T05]
R136  DNI_499_1%_0402  [RESC1005X40X25LL05T05]  (no BOM)
R137  499_1%_0402  [RESC1005X40X25LL05T05]
R138  10K_1%_0402  [RESC1005X40X25ML05T05]
SW1  B3U-1000P  [SW_OMRON_2P]  (value not drawn)
TP1  TP_PAD  [TP_PAD]
TP2  TP_PAD  [TP_PAD]
TP3  TP_PAD  [TP_PAD]

### Nets
GND: C171.2 C172.2 C173.2 C174.2 C175.2 C176.2 JA1.C1 JA1.C2 JA1.C5 JA1.C8 JA1.C11 JA1.C14 JA1.C17 JA1.C21 JA1.C25 JA1.C29 JA1.C33 JA1.C37 JA1.C41 JA1.C46 JA1.C49 JA1.C50 JA1.C53 JA1.C54 JA1.C57 JA1.C58 JA1.D3 JA1.D6 JA1.D9 JA1.D12 JA1.D15 JA1.D19 JA1.D23 JA1.D27 JA1.D31 JA1.D35 JA1.D39 JA1.D43 JA1.D47 JA1.D48 JA1.D51 JA1.D52 JA1.D55 JA1.D56 JA1.D59 MH1.1(GND) MH2.1(GND) MH3.1(GND) MH4.1(GND) R134.1 R135.1 R136.1 R137.1 R138.1 SW1.1(SW1)
P1V8: JA1.D1 JA1.D2
P5V0: C171.1 C172.1 C173.1 C174.1 JA1.C59 JA1.C60 JA1.D60
ANT1_IN: JA1.D16 ; off-sheet ANT1_IN
FWUEN_C2M_B: C176.1 JA1.C28 SW1.2(SW2) ; off-sheet FWUEN_C2M_B
GTR_DP1_C2M_N_NC: JA1.C56
GTR_DP1_C2M_P_NC: JA1.C55
GTR_DP2_M2C_N: JA1.D58 ; off-sheet GTR_DP2_M2C_N
GTR_DP2_M2C_P: JA1.D57 ; off-sheet GTR_DP2_M2C_P
GTR_DP3_C2M_N_NC: JA1.D50
GTR_DP3_C2M_P_NC: JA1.D49
GTR_DP3_M2C_N_NC: JA1.C52
GTR_DP3_M2C_P_NC: JA1.C51
GTR_REFCLK0_C2M_N: JA1.C48 ; off-sheet GTR_REFCLK0_C2M_N
GTR_REFCLK0_C2M_P: JA1.C47 ; off-sheet GTR_REFCLK0_C2M_P
GTR_REFCLK2_C2M_N: JA1.D54 ; off-sheet GTR_REFCLK2_C2M_N
GTR_REFCLK2_C2M_P: JA1.D53 ; off-sheet GTR_REFCLK2_C2M_P
HPA00_CC_N: JA1.C4 ; off-sheet HPA00_CC_N
HPA00_CC_P: JA1.C3 ; off-sheet HPA00_CC_P
HPA01_N: JA1.D8 ; off-sheet HPA01_N
HPA01_P: JA1.D7 ; off-sheet HPA01_P
HPA02_N: JA1.D5 ; off-sheet HPA02_N
HPA02_P: JA1.D4 ; off-sheet HPA02_P
HPA03_N: JA1.C7 ; off-sheet HPA03_N
HPA03_P: JA1.C6 ; off-sheet HPA03_P
HPA08_N: JA1.C10 ; off-sheet HPA08_N
HPA08_P: JA1.C9 ; off-sheet HPA08_P
HPA09_N: JA1.D11 ; off-sheet HPA09_N
HPA09_P: JA1.D10 ; off-sheet HPA09_P
HPA10_CC_N: JA1.C13 ; off-sheet HPA10_CC_N
HPA10_CC_P: JA1.C12 ; off-sheet HPA10_CC_P
HPA14_N_NC: JA1.D14
HPA14_P_NC: JA1.D13
I2C_SCK: JA1.D42 ; off-sheet I2C_SCK
I2C_SDA: JA1.C42 ; off-sheet I2C_SDA
JTAG_TCK_C2M: R133.2 ; off-sheet JTAG_TCK_C2M
MIO26: JA1.D28 ; off-sheet MIO26
MIO27: JA1.D29 ; off-sheet MIO27
MIO28: JA1.D30 ; off-sheet MIO28
MIO29: JA1.C30 ; off-sheet MIO29
MIO30: JA1.C31 ; off-sheet MIO30
MIO31: JA1.C32 R138.2 TP1.1(TP) ; off-sheet MIO31
MIO44: JA1.D32 ; off-sheet MIO44
MIO45: JA1.D33 ; off-sheet MIO45
MIO46: JA1.D34 ; off-sheet MIO46
MIO47: JA1.C34 ; off-sheet MIO47
MIO48: JA1.C35 ; off-sheet MIO48
MIO49: JA1.C36 ; off-sheet MIO49
MIO52: JA1.D36 ; off-sheet MIO52
MIO53: JA1.D37 ; off-sheet MIO53
MIO54: JA1.D38 ; off-sheet MIO54
MIO55: JA1.C38 ; off-sheet MIO55
MIO56: JA1.C39 ; off-sheet MIO56
MIO57: JA1.C40 ; off-sheet MIO57
MIO64: JA1.D40 ; off-sheet MIO64
MIO65: JA1.D41 ; off-sheet MIO65
MIO68: JA1.C43 ; off-sheet MIO68
MIO69: JA1.C44 ; off-sheet MIO69
MIO76: JA1.D44 ; off-sheet MIO76
MIO77: JA1.D45 ; off-sheet MIO77
MODE0_C2M: R137.2 ; off-sheet MODE0_C2M
MODE1_C2M: R136.2 ; off-sheet MODE1_C2M
MODE2_C2M: R135.2 ; off-sheet MODE2_C2M
MODE3_C2M: R134.2 ; off-sheet MODE3_C2M
PS_ERROR_OUT_M2C: TP2.1(TP) ; off-sheet PS_ERROR_OUT_M2C
PS_ERROR_STATUS_M2C: TP3.1(TP) ; off-sheet PS_ERROR_STATUS_M2C
PS_POR_B: JA1.C15 ; off-sheet PS_POR_B
PS_SRST_C2M_B: JA1.C16 ; off-sheet PS_SRST_C2M_B
PWRGD_FPD_M2C: JA1.D24 ; off-sheet PWRGD_FPD_M2C
PWRGD_LPD_M2C: JA1.D25 ; off-sheet PWRGD_LPD_M2C
PWRGD_PL_M2C: JA1.D26 ; off-sheet PWRGD_PL_M2C
Si5344_INT_N: JA1.D17 ; off-sheet Si5344_INT_N
Si5344_LOL: JA1.D20 ; off-sheet Si5344_LOL
Si5344_LOS_XAXB: JA1.D18 ; off-sheet Si5344_LOS_XAXB
SOM240_1_C45_NC: JA1.C45
SOM240_1_D46_NC: JA1.D46
NetC175_1: C175.1 R133.1

Not connected (* = marked no-connect by the designer): JA1 C18 C19 C20 C22 C23 C24 C26 C27 D21 D22

### Notes on the sheet
- SOM STANDOFFS
- HDA06
- HDA07
- HDA08 CC
- HDA00_CC
- HDA01
- HDA02
- HDA18
- HDA19
- HDA20
- HDA12
- HDA13
- HDA14
- SOM_5V0
- Connector Decoupling
- MIO67
- MIO66
- MODE PINS
- TCK TERM
- Quad-SPI (32b)
- FWUEN BUTTON
- SHUTDOWN
- PS_ERROR_OUT/STATUS
  TEST POINTS

### Library data of the parts
C171 C172 = CMP-2000-06341-2: as C132 on sheet 11-DisplayPort; Length: 2mm; Voltage Rating: 10V; Mount: Surface Mount; Width: 0.049inch; Voltage Rating (DC): 10V; Lead Free: Lead Free; REACH SVHC: No SVHC; Termination: SMD/SMT; Case/Package: 0805; Dielectric: X5R; Capacitance: 47uF; Packaging: Tape and Reel; Max Operating Temperature: 85°C; Tolerance: 20%; Thickness: 0.057inch; Dielectric Material: Ceramic; Min Operating Temperature: -55°C; Height: 1.25mm; Case Code (Imperial): 0805; Case Code (Metric): 2012; Depth: 1.25mm; Voltage: 10V
C173 = CMP-13271-001051-1: as C149 on sheet 12-USB Phy and Hub; Radiation Hardening: No; Lead Free: Lead Free; Capacitance: 1uF; Package Quantity: 10000; Max Operating Temperature: 85°C; Voltage Rating: 25V; Case/Package: 0402; Min Operating Temperature: -55°C; Packaging: Tape and Reel; Tolerance: 10%; Height: 0.5mm; Thickness: 0.022inch; Case Code (Metric): 1005; Width: 0.02inch; Case Code (Imperial): 0402; Dielectric: X5R; Length: 1mm; Mount: Surface Mount; Material: Ceramic; Depth: 0.5mm
C174 C176 = CMP-14477-000014-3: None; Voltage Rating (DC): 25V; Tolerance: 10%; Capacitance: 100nF; Dielectric: X5R; Max Operating Temperature: 85°C; Resistor Type: Ceramic; Packaging: Tape and Reel; Lead Free: Lead Free; Case Code (Imperial): 0402; Thickness: 0.022inch; Series: M; Construction: Flat; Number of Pins: 2; Width: 0.5mm; Halogen Free: Halogen Free; Case/Package: 0402; Voltage: 25V; Height: 0.5mm; Mount: Surface Mount; Min Operating Temperature: -55°C; Case Code (Metric): 1005; Length: 1mm; Depth: 0.5mm; Voltage Rating: 25V; Package Quantity: 1; Weight: 2.3E-05oz; RoHS Compliant: Yes; Termination: SMD/SMT; REACH SVHC: No SVHC
C175 = CMP-08246-002761-1: Multilayer Ceramic Capacitors 33pF ±1% 50V C0G SMD 0402; Weight: 2.3E-05oz; Case/Package: 0402; Mount: Surface Mount; REACH SVHC: No SVHC; Voltage Rating (DC): 50V; Voltage Rating: 50V; Max Operating Temperature: 125°C; Packaging: Tape and Reel; Length: 0.039inch; Dielectric: C0G; Case Code (Imperial): 0402; Height: 0.5mm; Termination: SMD/SMT; Min Operating Temperature: -55°C; Thickness: 0.022inch; Lead Free: Lead Free; Depth: 0.5mm; Dielectric Material: Ceramic; Package Quantity: 1; Case Code (Metric): 1005; Capacitance: 33pF; RoHS Compliant: Yes; Series: C; Width: 0.02inch; Tolerance: 1%
JA1 = SAMTEC-ADx6-60X4: Conn Rcpt Male Vert 240 Pos 4x60 0.635mm P Black SMT; Manufacturer: Samtec Inc.; Agile Part Number: CON-00383-01; SPLIT_INST: TRUE; SWAP_INFO: (S1+S2+S3+S4); Pitch: 0.025" (0.64mm); Barcode: 40000092; Datasheet: http://suddendocs.samtec.com/catalog_english/adf6.pdf; Manufacturer PN: ADM6-60-01.5-L-4-2-A-TR; PCB Footprint: CON_SAMTEC_ADM6_60_4; CIP Link: http://xsjbrdwin1/CIP-E/Component/Index/All?pn=40000092; Number of Pins: 240; Part Type: CONNECTOR
MH1-MH4 = MECH_SPACER: Standoff Female 3.3mm ID 5mm L 7.4mm OD SMT/TH Steel; Manufacturer: Würth Elektronik; Agile Part Number: MEC-00173-01; Barcode: 90000024; Datasheet: https://media.digikey.com/pdf/Data%20Sheets/Wurth%20Electronics%20PDFs/WA-SMSx_Performance_Flyer.pdf; Manufacturer PN: 9774050960R; Part Type: Mechanical Part; CIP Link: http://xsjbrdwin1/CIP-E/Component/Index/All?pn=90000024; PCB Footprint: CON_WE_WA-SMST_6MM
R133 = CMP-2002-05710-1: Manufacturer: TE Connectivity / AMP; Part Number: CRG0402F20R
R134-R137 = CMP-2002-00038-1: Manufacturer: Vishay Dale; Part Number: CRCW0402499RFKTD
R138 = CMP-2002-00433-1: as R90 on sheet 11-DisplayPort
SW1 = BTN_MOMENT: Switch SPST-NO Mom 50mA 12V 1.6mm H 1.5Nw SMT IP40; Manufacturer: OMRON; Agile Part Number: SWH-00003-01; EDMVersionID: 489329634; Barcode: 440024; Manufacturer PN: B3U-1000P; PCB Footprint: SW_OMRON_2P; CIP Link: http://xsjbrdwin1/CIP-E/Component/Index/All?pn=440024; Part Type: MOMENT
TP1-TP3 = TP: TEST POINT 24mil SM pad; EDMVersionID: 493452275; ASSEMBLY_OPTIONS: DNP; Barcode: 96000010; MANF_P/N: DNP; OWNER: 3709; PCB Footprint: TP_PAD; PartType: TEST POINT; Pins: 1PIN; ROHS: Yes; Datasheet: NA; MANF: DNP; DEVICE: TP_PAD; Part Type: Unassigned Part Type; CIP Link: http://xsjbrdwin1/CIP-E/Component/Index/All?pn=96000010

## Sheet 17-FPGA-02b.SchDoc
size B; SheetNumber: 17; SheetTotal: 19
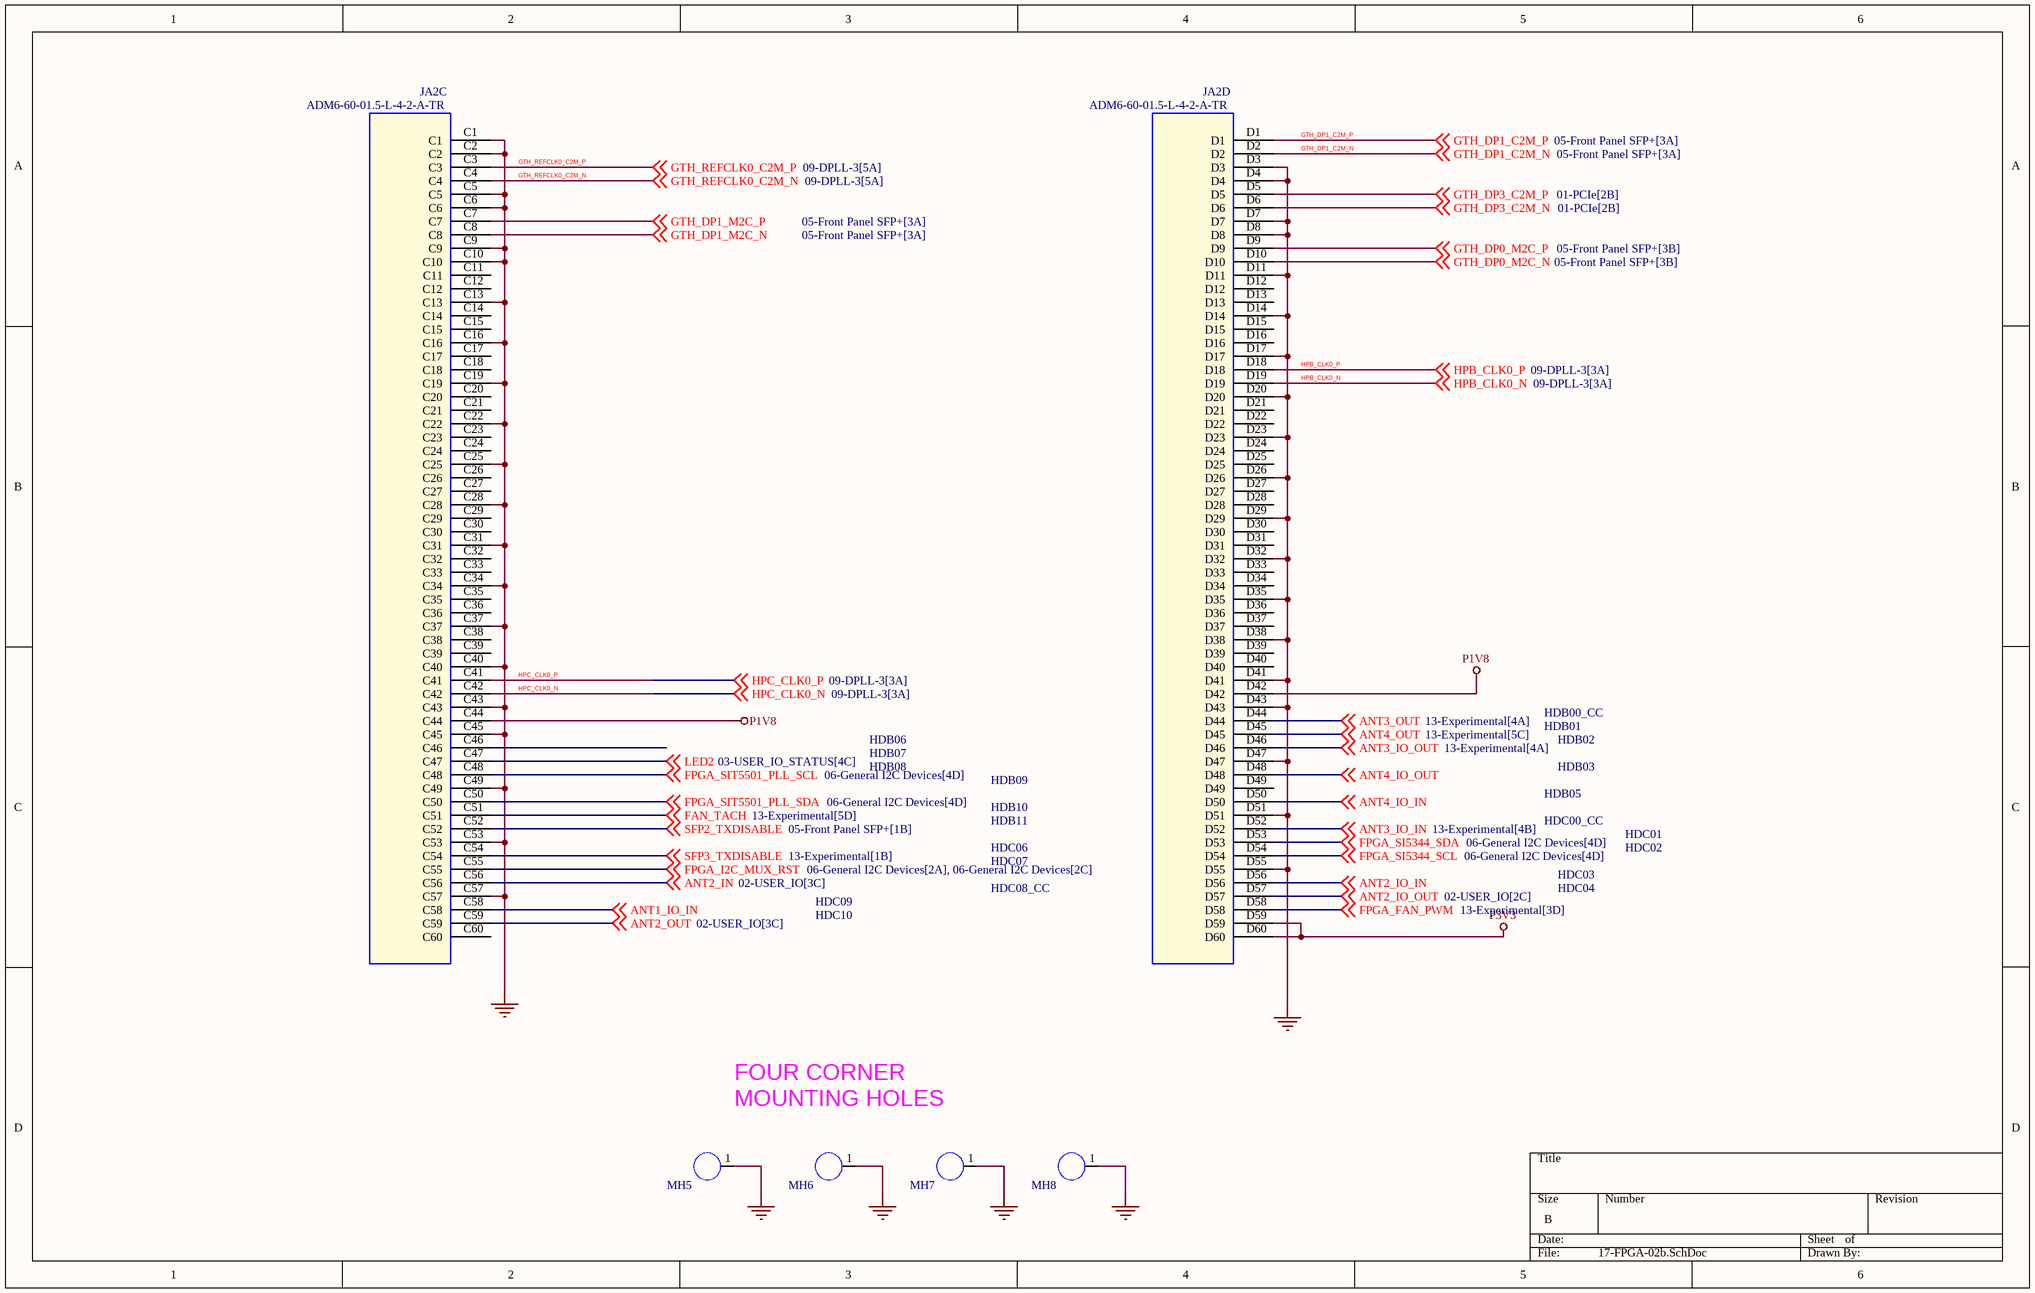
[diagram p8: 17-FPGA-02b.SchDoc]

### Parts
JA2  ADM6-60-01.5-L-4-2-A-TR  [CON_SAMTEC_ADM6_60_4]  (parts C,D of 4)
MH5  MH_NP_M3_SO_600  [MH_NP_M3_SO_600]  (value not drawn)
MH6  MH_NP_M3_SO_600  [MH_NP_M3_SO_600]  (value not drawn)
MH7  MH_NP_M3_SO_600  [MH_NP_M3_SO_600]  (value not drawn)
MH8  MH_NP_M3_SO_600  [MH_NP_M3_SO_600]  (value not drawn)

### Nets
GND: JA2.C1 JA2.C2 JA2.C5 JA2.C6 JA2.C9 JA2.C10 JA2.C13 JA2.C16 JA2.C19 JA2.C22 JA2.C25 JA2.C28 JA2.C31 JA2.C34 JA2.C37 JA2.C40 JA2.C43 JA2.C45 JA2.C49 JA2.C53 JA2.C57 JA2.D3 JA2.D4 JA2.D7 JA2.D8 JA2.D11 JA2.D14 JA2.D17 JA2.D20 JA2.D23 JA2.D26 JA2.D29 JA2.D32 JA2.D35 JA2.D38 JA2.D41 JA2.D43 JA2.D47 JA2.D51 JA2.D55 MH5.1 MH6.1 MH7.1 MH8.1
P1V8: JA2.C44 JA2.D42
P3V3: JA2.D59 JA2.D60
ANT1_IO_IN: JA2.C58 ; off-sheet ANT1_IO_IN
ANT2_IN: JA2.C56 ; off-sheet ANT2_IN
ANT2_IO_IN: JA2.D56 ; off-sheet ANT2_IO_IN
ANT2_IO_OUT: JA2.D57 ; off-sheet ANT2_IO_OUT
ANT2_OUT: JA2.C59 ; off-sheet ANT2_OUT
ANT3_IO_IN: JA2.D52 ; off-sheet ANT3_IO_IN
ANT3_IO_OUT: JA2.D46 ; off-sheet ANT3_IO_OUT
ANT3_OUT: JA2.D44 ; off-sheet ANT3_OUT
ANT4_IO_IN: JA2.D50 ; off-sheet ANT4_IO_IN
ANT4_IO_OUT: JA2.D48 ; off-sheet ANT4_IO_OUT
ANT4_OUT: JA2.D45 ; off-sheet ANT4_OUT
FAN_TACH: JA2.C51 ; off-sheet FAN_TACH
FPGA_FAN_PWM: JA2.D58 ; off-sheet FPGA_FAN_PWM
FPGA_I2C_MUX_RST: JA2.C55 ; off-sheet FPGA_I2C_MUX_RST
FPGA_SI5344_SCL: JA2.D54 ; off-sheet FPGA_SI5344_SCL
FPGA_SI5344_SDA: JA2.D53 ; off-sheet FPGA_SI5344_SDA
FPGA_SIT5501_PLL_SCL: JA2.C48 ; off-sheet FPGA_SIT5501_PLL_SCL
FPGA_SIT5501_PLL_SDA: JA2.C50 ; off-sheet FPGA_SIT5501_PLL_SDA
GTH_DP0_M2C_N: JA2.D10 ; off-sheet GTH_DP0_M2C_N
GTH_DP0_M2C_P: JA2.D9 ; off-sheet GTH_DP0_M2C_P
GTH_DP1_C2M_N: JA2.D2 ; off-sheet GTH_DP1_C2M_N
GTH_DP1_C2M_P: JA2.D1 ; off-sheet GTH_DP1_C2M_P
GTH_DP1_M2C_N: JA2.C8 ; off-sheet GTH_DP1_M2C_N
GTH_DP1_M2C_P: JA2.C7 ; off-sheet GTH_DP1_M2C_P
GTH_DP3_C2M_N: JA2.D6 ; off-sheet GTH_DP3_C2M_N
GTH_DP3_C2M_P: JA2.D5 ; off-sheet GTH_DP3_C2M_P
GTH_REFCLK0_C2M_N: JA2.C4 ; off-sheet GTH_REFCLK0_C2M_N
GTH_REFCLK0_C2M_P: JA2.C3 ; off-sheet GTH_REFCLK0_C2M_P
HPB_CLK0_N: JA2.D19 ; off-sheet HPB_CLK0_N
HPB_CLK0_P: JA2.D18 ; off-sheet HPB_CLK0_P
HPC_CLK0_N: JA2.C42 ; off-sheet HPC_CLK0_N
HPC_CLK0_P: JA2.C41 ; off-sheet HPC_CLK0_P
LED2: JA2.C47 ; off-sheet LED2
SFP2_TXDISABLE: JA2.C52 ; off-sheet SFP2_TXDISABLE
SFP3_TXDISABLE: JA2.C54 ; off-sheet SFP3_TXDISABLE

Not connected (* = marked no-connect by the designer): JA2 C11 C12 C14 C15 C17 C18 C20 C21 C23 C24 C26 C27 C29 C30 C32 C33 C35 C36 C38 C39 C46 C60 D12 D13 D15 D16 D21 D22 D24 D25 D27 D28 D30 D31 D33 D34 D36 D37 D39 D40 D49

### Notes on the sheet
- HDB06
- HDB07
- HDB08
- HDB00_CC
- HDB01
- HDB02
- HDB03
- HDB09
- HDB10
- HDB11
- HDC00_CC
- HDB05
- HDC01
- HDC09
- HDC06
- HDC07
- HDC08_CC
- HDC03
- HDC04
- HDC02
- HDC10
- FOUR CORNER
  MOUNTING HOLES

### Library data of the parts
JA2 = SAMTEC-ADx6-60X4: Conn Rcpt Male Vert 240 Pos 4x60 0.635mm P Black SMT; Manufacturer: Samtec Inc.; Agile Part Number: CON-00383-01; SPLIT_INST: TRUE; SWAP_INFO: (S1+S2+S3+S4); Barcode: 40000092; Pitch: 0.025" (0.64mm); Datasheet: http://suddendocs.samtec.com/catalog_english/adf6.pdf; Manufacturer PN: ADM6-60-01.5-L-4-2-A-TR; PCB Footprint: CON_SAMTEC_ADM6_60_4; Part Type: CONNECTOR; Number of Pins: 240; CIP Link: http://xsjbrdwin1/CIP-E/Component/Index/All?pn=40000092
MH5-MH8 = HOLE: MOUNTING HOLE, NON-PLATED 3.4MM HOLE; EDMVersionID: 490415297; Barcode: 96000044; ASSEMBLY_OPTIONS: DNP; PCB Footprint: MH_NP_M3_SO_600; CIP Link: http://xsjbrdwin1/CIP-E/Component/Index/All?pn=96000044; Part Type: HOLE